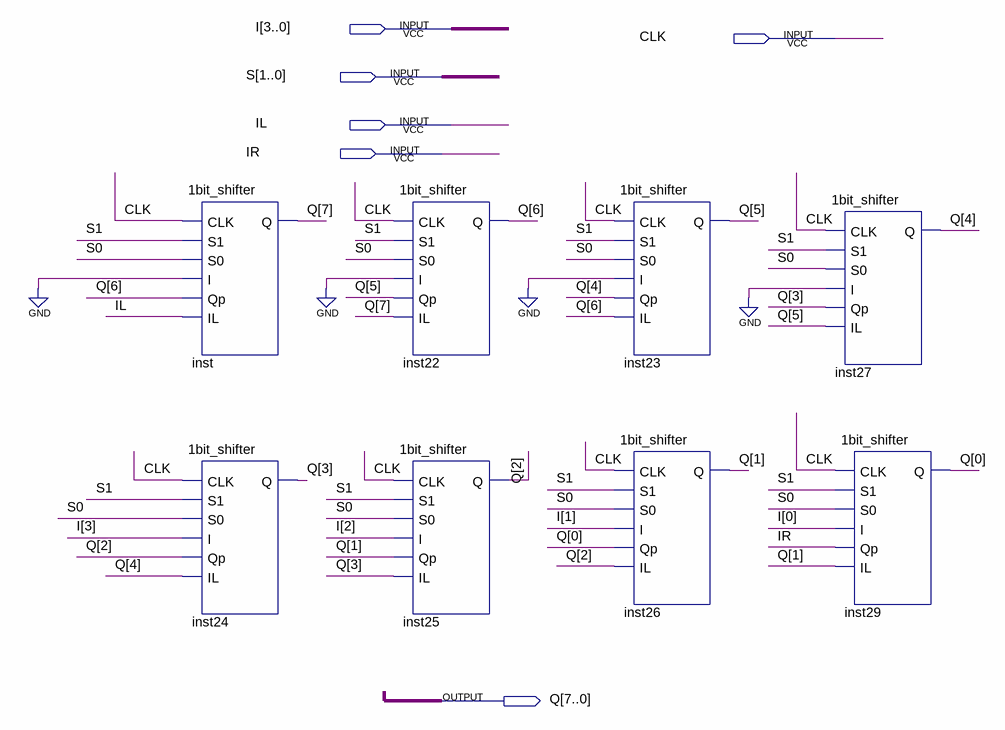
[diagram p0: schematic sheet]
// Quartus schematic Multiplier.bdf as structural Verilog: 8 symbols, 6 pins
module Multiplier (
  input  [3:0] I,
  input  CLK,
  input  [1:0] S,
  input  IL,
  input  IR,
  output [7:0] Q
);

  \1bit_shifter  inst (.CLK(CLK), .S1(S[1]), .S0(S[0]), .I(1'b0), .Qp(Q[6]), .IL(IL), .Q(Q[7]));
  \1bit_shifter  inst24 (.CLK(CLK), .S1(S[1]), .S0(S[0]), .I(I[3]), .Qp(Q[2]), .IL(Q[4]), .Q(Q[3]));
  \1bit_shifter  inst22 (.CLK(CLK), .S1(S[1]), .S0(S[0]), .I(1'b0), .Qp(Q[5]), .IL(Q[7]), .Q(Q[6]));
  \1bit_shifter  inst25 (.CLK(CLK), .S1(S[1]), .S0(S[0]), .I(I[2]), .Qp(Q[1]), .IL(Q[3]), .Q(Q[2]));
  \1bit_shifter  inst23 (.CLK(CLK), .S1(S[1]), .S0(S[0]), .I(1'b0), .Qp(Q[4]), .IL(Q[6]), .Q(Q[5]));
  \1bit_shifter  inst26 (.CLK(CLK), .S1(S[1]), .S0(S[0]), .I(I[1]), .Qp(Q[0]), .IL(Q[2]), .Q(Q[1]));
  \1bit_shifter  inst27 (.CLK(CLK), .S1(S[1]), .S0(S[0]), .I(1'b0), .Qp(Q[3]), .IL(Q[5]), .Q(Q[4]));
  \1bit_shifter  inst29 (.CLK(CLK), .S1(S[1]), .S0(S[0]), .I(I[0]), .Qp(IR), .IL(Q[1]), .Q(Q[0]));
endmodule
